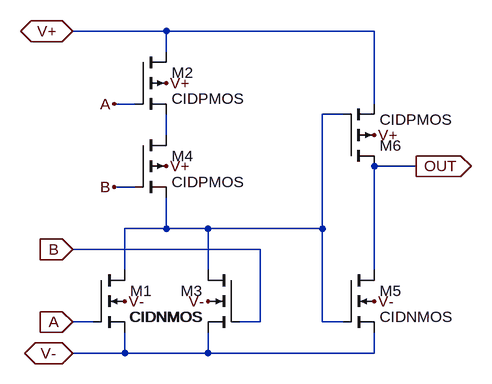
[diagram p0: schematic OR2X1.asc]
OR2X1.asc, the LTspice schematic file:
Version 4.1
SHEET 1 880 680
WIRE 208 -160 64 -160
WIRE 528 -160 208 -160
WIRE 208 -128 208 -160
WIRE 160 -48 128 -48
WIRE 528 -48 528 -160
WIRE 480 -32 448 -32
WIRE 208 0 208 -32
WIRE 592 48 528 48
WIRE 160 80 128 80
WIRE 208 144 208 96
WIRE 208 144 144 144
WIRE 272 144 208 144
WIRE 448 144 448 -32
WIRE 448 144 272 144
WIRE 352 176 64 176
WIRE 144 208 144 144
WIRE 272 208 272 144
WIRE 528 208 528 48
WIRE 96 288 64 288
WIRE 352 288 352 176
WIRE 352 288 320 288
WIRE 448 288 448 144
WIRE 480 288 448 288
WIRE 144 336 144 304
WIRE 144 336 64 336
WIRE 272 336 272 304
WIRE 272 336 144 336
WIRE 528 336 528 304
WIRE 528 336 272 336
FLAG 64 288 A
IOPIN 64 288 In
FLAG 64 176 B
IOPIN 64 176 In
FLAG 128 -48 A
FLAG 128 80 B
FLAG 64 -160 V+
IOPIN 64 -160 BiDir
FLAG 272 256 V-
FLAG 144 256 V-
FLAG 208 -80 V+
FLAG 208 48 V+
FLAG 64 336 V-
IOPIN 64 336 BiDir
FLAG 592 48 OUT
IOPIN 592 48 Out
FLAG 528 0 V+
FLAG 528 256 V-
SYMBOL nmos4 96 208 R0
SYMATTR InstName M1
SYMATTR Value CIDNMOS
SYMATTR Value2 l=5u w=10u
SYMBOL pmos4 160 -128 R0
SYMATTR InstName M2
SYMATTR Value CIDPMOS
SYMATTR Value2 l=5u w=25u
SYMBOL nmos4 320 208 M0
SYMATTR InstName M3
SYMATTR Value CIDNMOS
SYMATTR Value2 l=5u w=10u
SYMBOL pmos4 160 0 R0
SYMATTR InstName M4
SYMATTR Value CIDPMOS
SYMATTR Value2 l=5u w=25u
SYMBOL nmos4 480 208 R0
SYMATTR InstName M5
SYMATTR Value CIDNMOS
SYMATTR Value2 l=5u w=10u
SYMBOL pmos4 480 48 M180
SYMATTR InstName M6
SYMATTR Value CIDPMOS
SYMATTR Value2 l=5u w=25u

The netlist it stands for:
* OR2X1.asc
M1 N001 A V- V- CIDNMOS l=5u w=10u
M2 V+ A N002 V+ CIDPMOS l=5u w=25u
M3 N001 B V- V- CIDNMOS l=5u w=10u
M4 N002 B N001 V+ CIDPMOS l=5u w=25u
M5 OUT N001 V- V- CIDNMOS l=5u w=10u
M6 OUT N001 V+ V+ CIDPMOS l=5u w=25u
.model NMOS NMOS
.model PMOS PMOS
.lib standard.mos
.backanno
.end